# EasyEDA schematic thermo-stats.json
TITLE: Sheet_1; REV: 1.0; Date: 2020-12-25; Sheet: 1/1; Company: Your Company
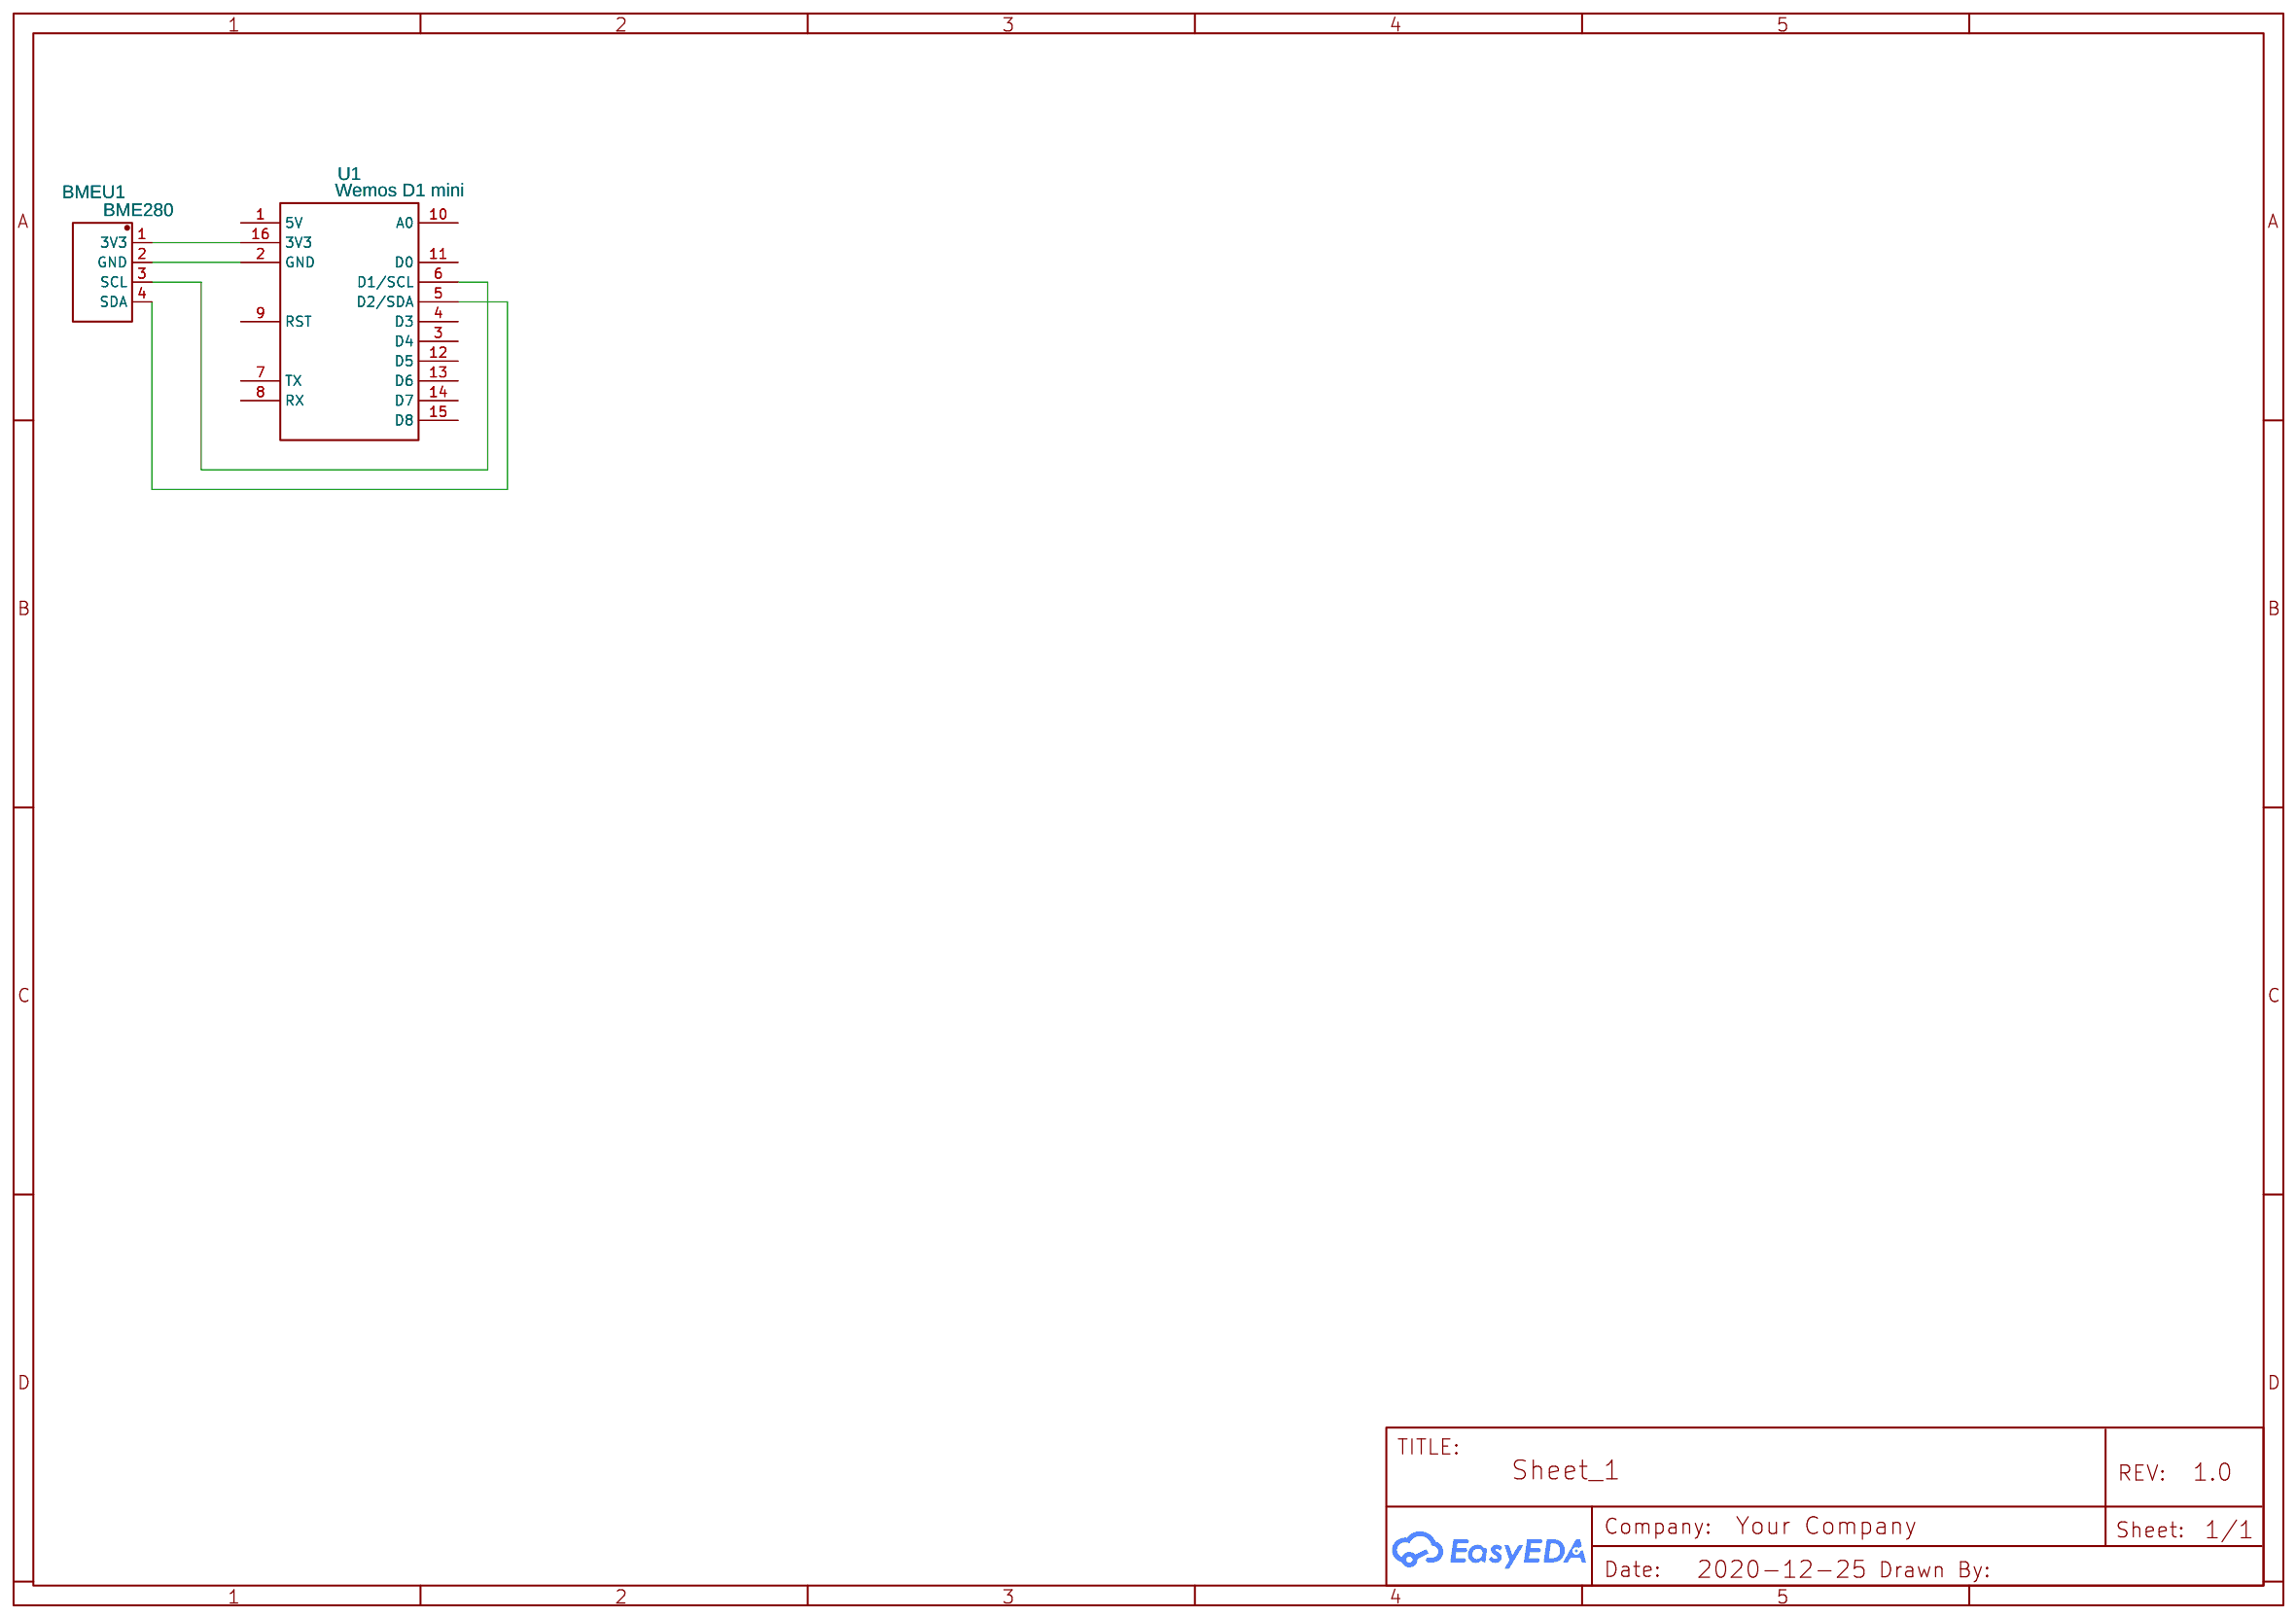
[diagram p0: schematic sheet]

## Parts
BMEU1  BME280  [BME280]
U1  Wemos D1 mini  [WEMOS D1 MINI]

## Library data of the parts
BMEU1 = -: Manufacturer Part: ?
U1 = Wemos D1 mini: Contributor: redstar2k

## Nets
Net-(BMEU1-1): BMEU1.1(3V3) U1.16(3V3)
Net-(BMEU1-2): BMEU1.2(GND) U1.2(GND)
Net-(BMEU1-3): BMEU1.3(SCL) U1.6(D1/SCL)
Net-(BMEU1-4): BMEU1.4(SDA) U1.5(D2/SDA)

Not connected (* = marked no-connect by the designer): U1 1(5V) 3(D4) 4(D3) 7(TX) 8(RX) 9(RST) 10(A0) 11(D0) 12(D5) 13(D6) 14(D7) 15(D8)
